# EAGLE board DP_current_measure_v2 (EAGLE 9.4.2)
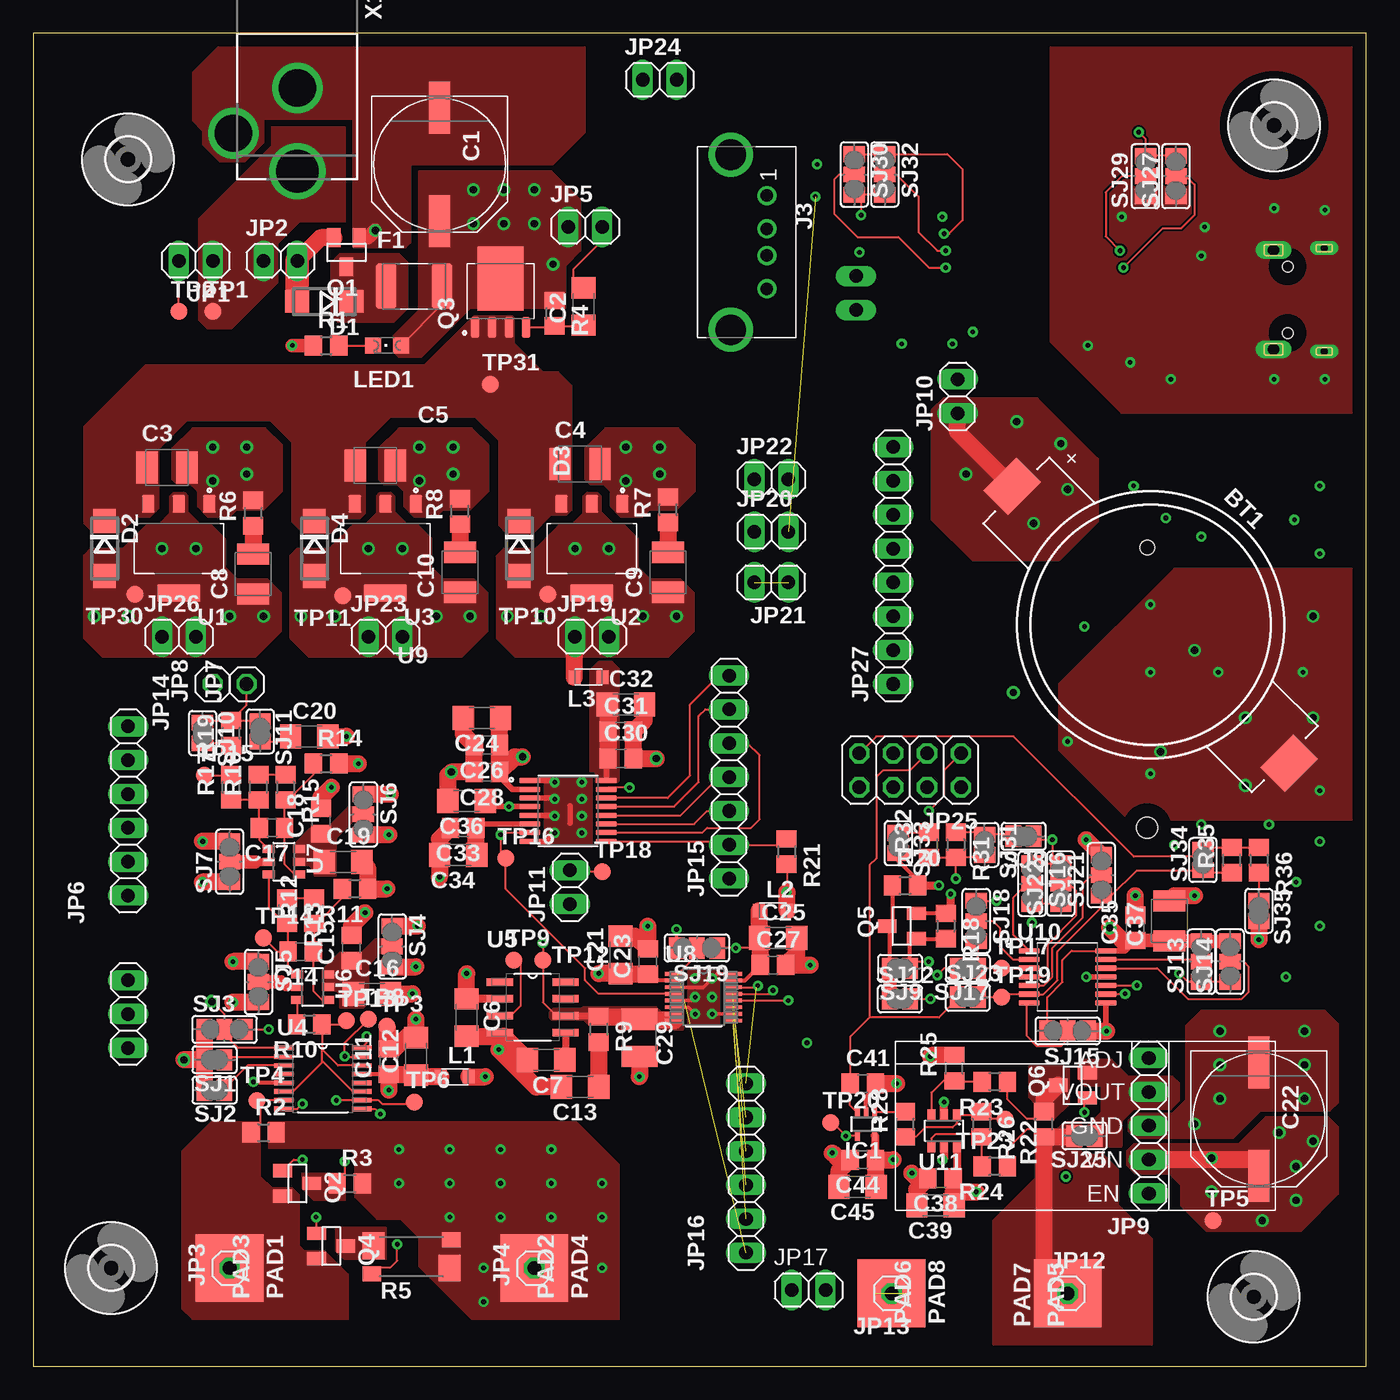
[diagram p5: board, top side]
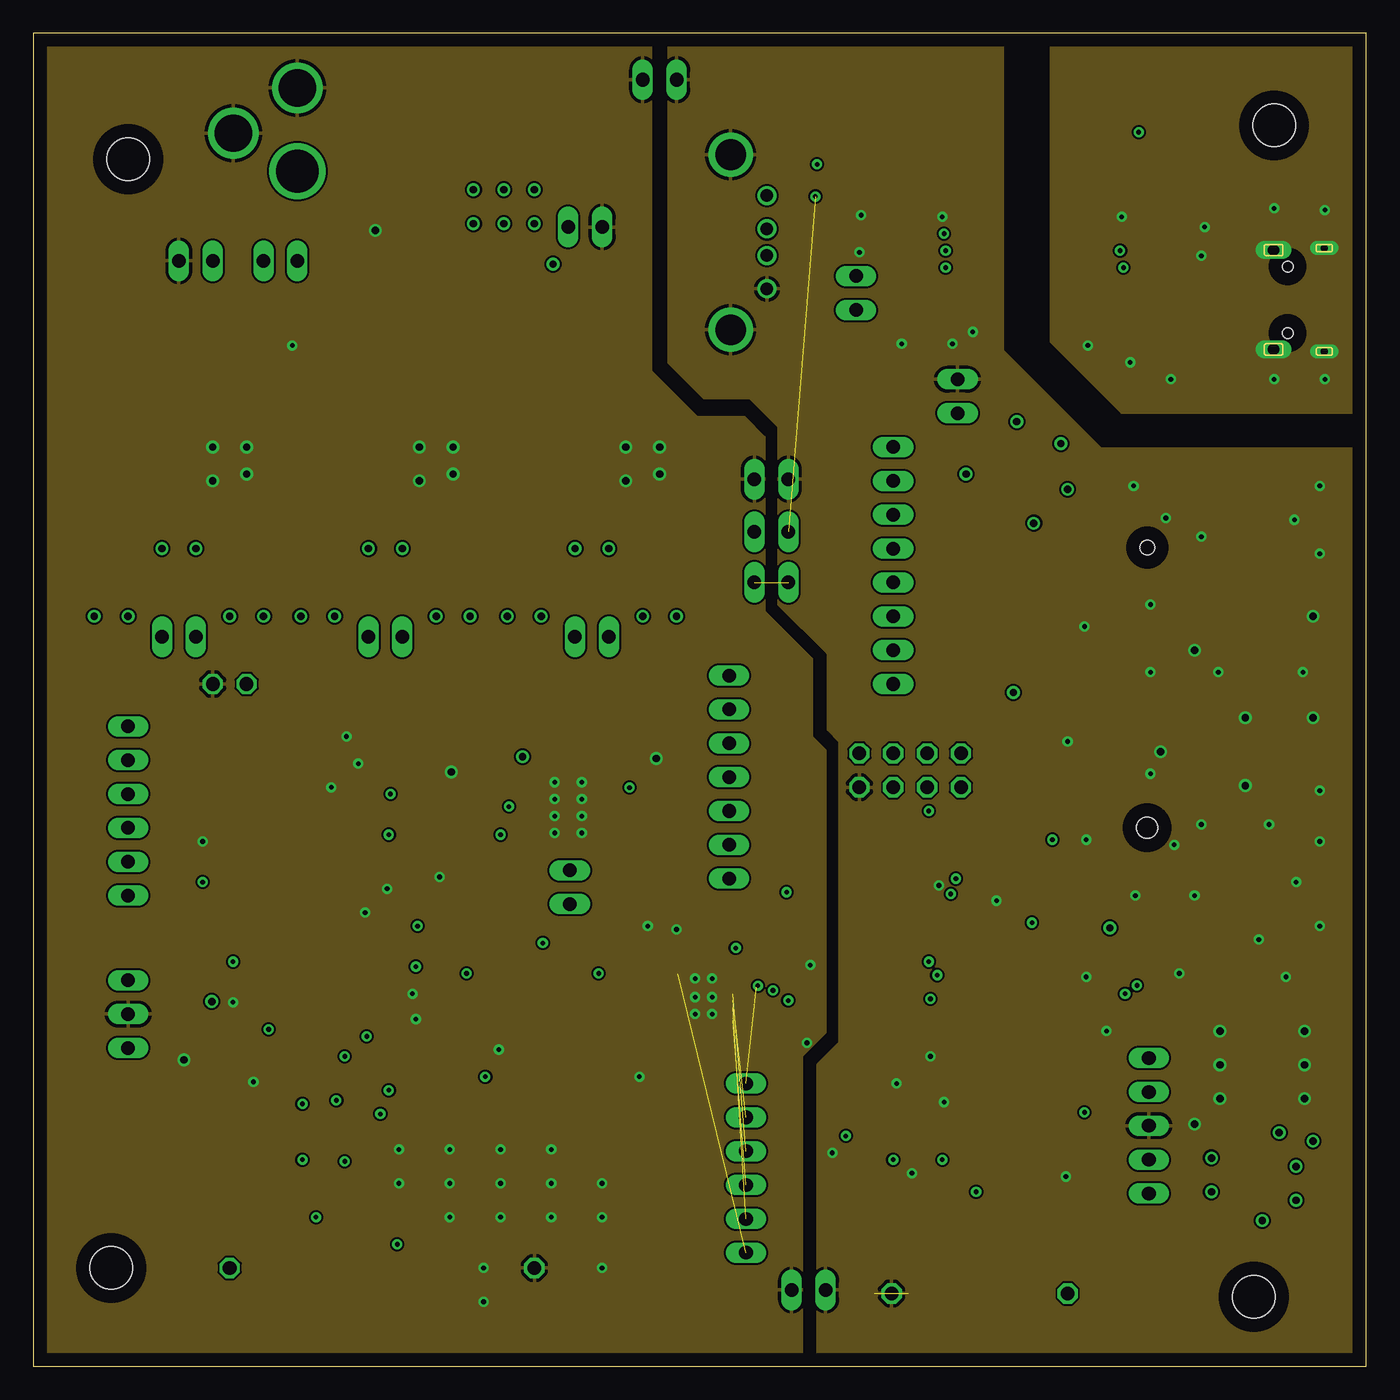
[diagram p6: board, inner layer Route2]
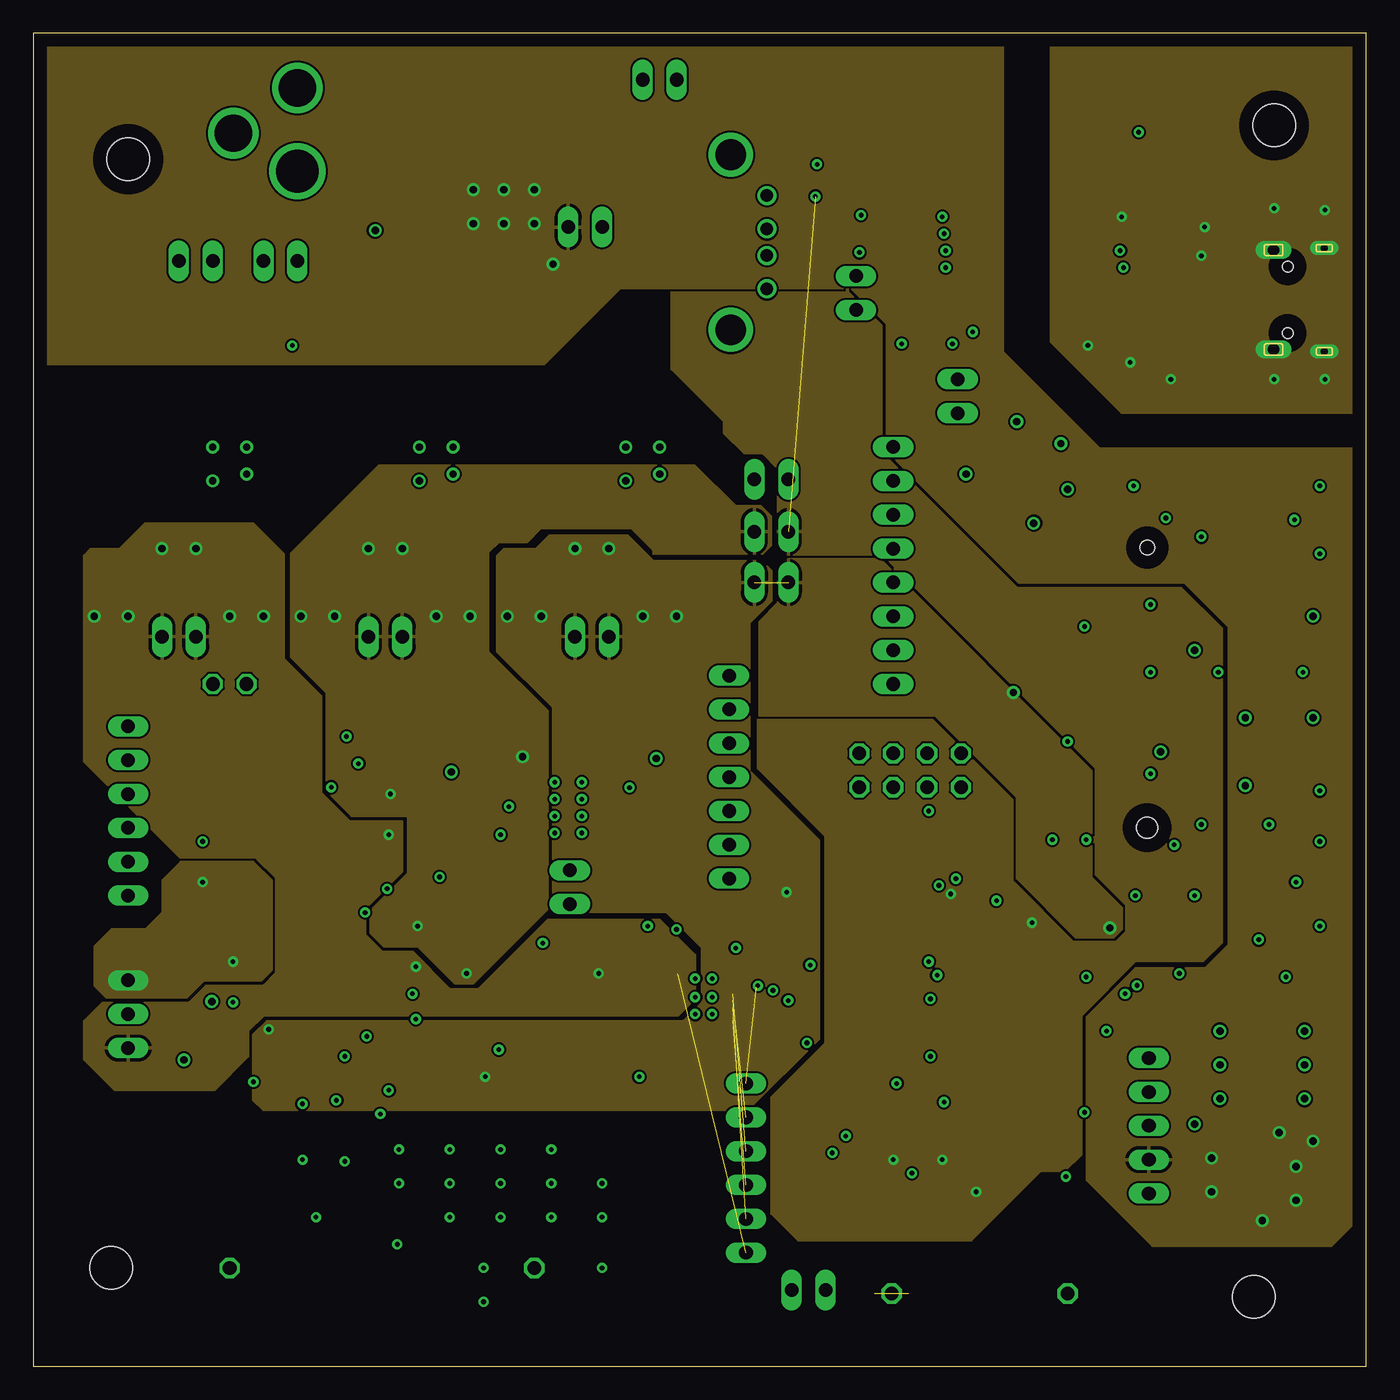
[diagram p7: board, inner layer Route15]
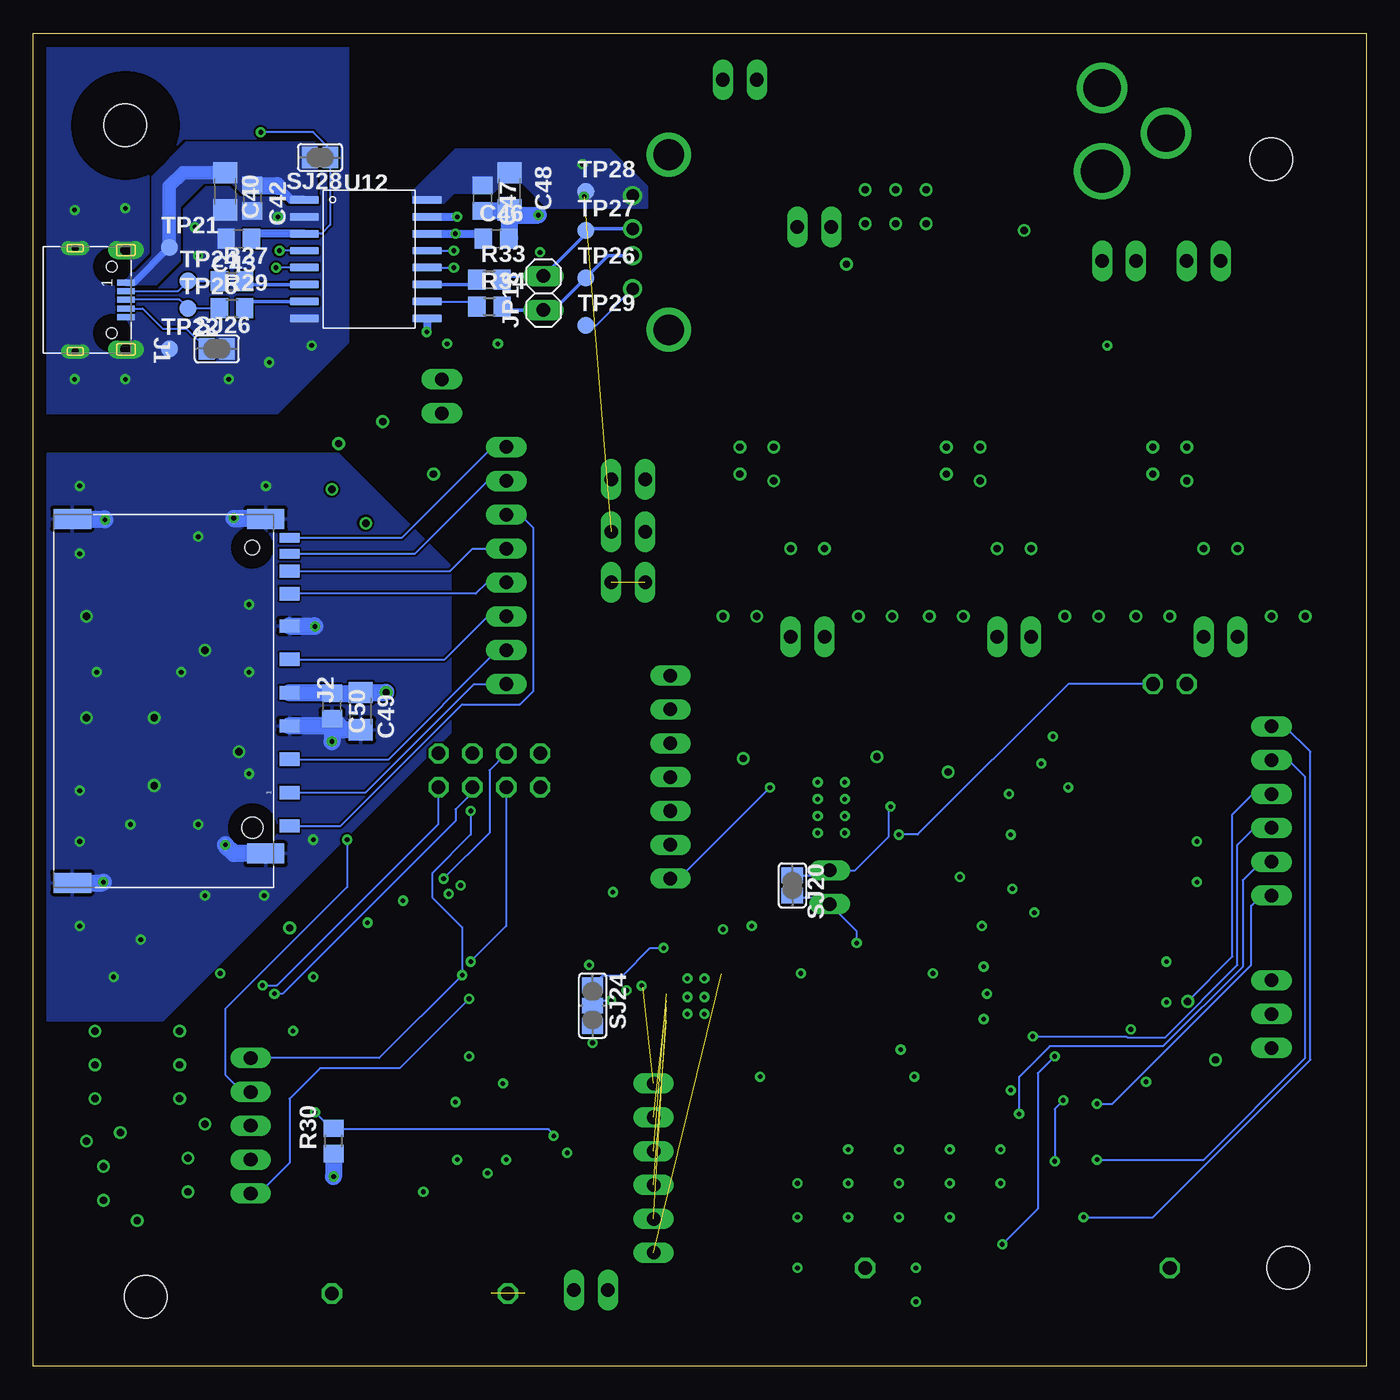
[diagram p8: board, bottom side, seen from below]

Size 100 x 100 mm. Coordinates in mm from the lower left corner, seen from the top.
Outline: 0,0 100,0 100,100 0,100 0,0
Copper layers (1+2*15+16): Top 0.035mm / dielectric 0.2mm / Route2 0.0175mm / dielectric 1.065mm / Route15 0.0175mm / dielectric 0.2mm / Bottom 0.035mm
Design rules "default *": minimum track width 6mil, minimum drill 0.35mm, track to track 6mil, track to pad 6mil, pad to pad 6mil, via to via 6mil, smd to smd 6mil, copper to edge 40mil, drill to drill 6mil, minimum pad ring 10mil, minimum via ring 8mil, stop-mask expansion 4mil, vias tented up to drill 0mil, thermal gap 10mil
Net classes: 1 diff_pair: width 0.254 mm

## Footprints (pad centres in the part's own frame; a part is rotated, then mirrored left to right if it is on the bottom)
RENATA_SMTU2032-1 = smd 2.6 x 3.5: 1 -14.7,0; 2 14.7,0
PANASONIC_G = smd 3.9 x 1.6: + 4.25,0; - -4.25,0
C1206 = smd 1.6 x 1.8: 1 -1.4,0; 2 1.4,0
SMC_B = smd 1.6 x 2.4: + -1.5,0; - 1.5,0
C0805 = smd 1.3 x 1.5: 1 -0.95,0; 2 0.95,0
C1210 = smd 1.6 x 2.7: 1 -1.4,0; 2 1.4,0
DO214AC = smd 1.8 x 1.7: A 2.05,0; C -2.05,0
1812 = smd 1.58 x 3.43: 1 -2.1,0; 2 2.1,0
3,2 = hole 3.2: 0,0
SC70-5L = smd 0.35 x 0.8: 1 -0.65,-0.85; 2 0,-0.85; 3 0.65,-0.85; 4 0.65,0.85; 5 -0.65,0.85
629105150521 = smd 0.45 x 1.3: 1 -1.3,1.05; 2 -0.65,1.05; 3 0,1.05; 4 0.65,1.05; 5 1.3,1.05 | drill 0.85 pad 1.2 long: SHELL -3.725,1.05; SHELL1 3.725,1.05 | drill 0.55 pad 0.9 long: SHELL2 -3.875,-2.75; SHELL3 3.875,-2.75 | hole 0.8: -2.5,0; 2.5,0
693063020911 = smd 1 x 1.5: 1 6.875,0; 2 4.375,0; 3 1.875,0; 4 -0.625,0; 5 -3.125,0; 6 -5.625,0; 7 -8.05,0; 8 -9.75,0; 9 9.375,0 | smd 0.7 x 1.5: CD -11.05,0; WP -12.25,0 | smd 1.5 x 2.8: GND1 -13.65,-1.8; GND2 11.45,-1.8; GND3 13.65,-16.3; GND4 -13.65,-16.3 | hole 1.1: -11.5,-2.8 | hole 1.6: 9.5,-2.8
614004185023 = drill 0.92: 1 -3.5,2.71; 2 -1,2.71; 3 1,2.71; 4 3.5,2.71 | drill 2.3: SHELL 6.57,0; SHELL1 -6.57,0
1X02 = drill 1.016 long: 1 -1.27,0; 2 1.27,0
1X01 = drill 1.016 octagon: 1 0,0
1X03 = drill 1.016 long: 1 -2.54,0; 2 0,0; 3 2.54,0
1X05 = drill 1.016 long: 1 -5.08,0; 2 -2.54,0; 3 0,0; 4 2.54,0; 5 5.08,0
1X06 = drill 1.016 long: 1 -6.35,0; 2 -3.81,0; 3 -1.27,0; 4 1.27,0; 5 3.81,0; 6 6.35,0
1X07 = drill 1.016 long: 1 -7.62,0; 2 -5.08,0; 3 -2.54,0; 4 0,0; 5 2.54,0; 6 5.08,0; 7 7.62,0
2X04 = drill 1.016 octagon: 1 -3.81,-1.27; 2 -3.81,1.27; 3 -1.27,-1.27; 4 -1.27,1.27; 5 1.27,-1.27; 6 1.27,1.27; 7 3.81,-1.27; 8 3.81,1.27
1X08 = drill 1.016 long: 1 -8.89,0; 2 -6.35,0; 3 -3.81,0; 4 -1.27,0; 5 1.27,0; 6 3.81,0; 7 6.35,0; 8 8.89,0
WE-CBF_0805(W=3.0) = smd 0.9 x 1: 1 -1.05,0; 2 1.05,0
CHIPLED_0805 = smd 1.2 x 1.2: A 0,-1.05; C 0,1.05
SMD2,54-5,08 = smd 2.54 x 5.08: 1 0,0
SOT23 = smd 1 x 1.4: 1 -0.95,-1.1; 2 0.95,-1.1; 3 0,1.1
TO127P600X120-5N = smd 0.64 x 1.57: 1 -1.905,-2.57; 2 -0.635,-2.57; 3 0.635,-2.57; 4 1.905,-2.57 | smd 3.47 x 4.8: 5 0,1.06
R0805 = smd 1.3 x 1.5: 1 -0.95,0; 2 0.95,0
R2512 = smd 1.39 x 1.14: E1 -0.13,-2.105; E2 5.84,0.435 | smd 1.65 x 2.01: I1 0,0; I2 5.71,-1.67
SJ = smd 1.168 x 1.6: 1 -0.762,0; 2 0.762,0
SJ_2 = smd 1.168 x 1.6: 1 -1.524,0; 2 0,0; 3 1.524,0
B1,27 = smd 1.27 x 1.27: TP 0,0
SOT229P700X180-4N = smd 0.93 x 1.31: 1 -2.29,-3.345; 2 0,-3.345; 3 2.29,-3.345 | smd 3.24 x 1.31: 4 0,3.345
SOP65P640X110-16N = smd 1.473 x 0.356: 1 -2.921,2.286; 2 -2.921,1.626; 3 -2.921,0.965; 4 -2.921,0.33; 5 -2.921,-0.33; 6 -2.921,-0.965; 7 -2.921,-1.626; 8 -2.921,-2.286; 9 2.921,-2.286; 10 2.921,-1.626; 11 2.921,-0.965; 12 2.921,-0.33; 13 2.921,0.33; 14 2.921,0.965; 15 2.921,1.626; 16 2.921,2.286
SOIC127P600X175-8N = smd 1.981 x 0.559: 1 -2.464,1.905; 2 -2.464,0.635; 3 -2.464,-0.635; 4 -2.464,-1.905; 5 2.464,-1.905; 6 2.464,-0.635; 7 2.464,0.635; 8 2.464,1.905
SOT23-6 = smd 0.6 x 0.9: 1 -0.95,-1.15; 2 0,-1.15; 3 0.95,-1.15; 4 0.95,1.15; 5 0,1.15; 6 -0.95,1.15
MSOP-16_MS = smd 1.397 x 0.279: 1 -2.184,1.751; 2 -2.184,1.251; 3 -2.184,0.751; 4 -2.184,0.25; 5 -2.184,-0.25; 6 -2.184,-0.751; 7 -2.184,-1.251; 8 -2.184,-1.751; 9 2.184,-1.751; 10 2.184,-1.251; 11 2.184,-0.751; 12 2.184,-0.25; 13 2.184,0.25; 14 2.184,0.751; 15 2.184,1.251; 16 2.184,1.751
SOP65P640X120-16N = smd 1.57 x 0.41: 1 -2.87,2.275; 2 -2.87,1.625; 3 -2.87,0.975; 4 -2.87,0.325; 5 -2.87,-0.325; 6 -2.87,-0.975; 7 -2.87,-1.625; 8 -2.87,-2.275; 9 2.87,-2.275; 10 2.87,-1.625; 11 2.87,-0.975; 12 2.87,-0.325; 13 2.87,0.325; 14 2.87,0.975; 15 2.87,1.625; 16 2.87,2.275
SOP65P640X120-14N = smd 1.57 x 0.41: 1 -2.87,1.95; 2 -2.87,1.3; 3 -2.87,0.65; 4 -2.87,0; 5 -2.87,-0.65; 6 -2.87,-1.3; 7 -2.87,-1.95; 8 2.87,-1.95; 9 2.87,-1.3; 10 2.87,-0.65; 11 2.87,0; 12 2.87,0.65; 13 2.87,1.3; 14 2.87,1.95
SO16W = smd 2.2 x 0.6: 1 -4.6,4.445; 2 -4.6,3.175; 3 -4.6,1.905; 4 -4.6,0.635; 5 -4.6,-0.635; 6 -4.6,-1.905; 7 -4.6,-3.175; 8 -4.6,-4.445; 9 4.6,-4.445; 10 4.6,-3.175; 11 4.6,-1.905; 12 4.6,-0.635; 13 4.6,0.635; 14 4.6,1.905; 15 4.6,3.175; 16 4.6,4.445
DCJACK_2MM_PTH = drill 2.8: GND 0,7.35; GNDBREAK 4.8,10.75 | drill 3.2: PWR 0,13.6

## Placement (x,y rotation side)
BT1  SMTU2032-1  [RENATA_SMTU2032-1]  83.82,55.63 315 top
C1  470u  [PANASONIC_G]  30.48,90.17 270 top
C2  10u  [C1206]  41.27,79.5 90 top
C3  10u  [SMC_B]  10.03,67.44 0 top
C4  10u  [SMC_B]  41.02,67.69 0 top
C5  10u  [SMC_B]  25.65,67.56 0 top
C6  10u  [C1206]  32.51,26.16 270 top
C7  10u  [C1206]  38.48,22.99 180 top
C8  10u  [SMC_B]  16.51,59.44 90 top
C9  10u  [SMC_B]  47.62,59.56 90 top
C10  10u  [SMC_B]  32,59.56 90 top
C11  100n  [C0805]  26.67,22.86 90 top
C12  10u  [C1206]  28.7,23.24 90 top
C13  10u  [C1206]  41.02,20.95 180 top
C14  10p  [C0805]  20.07,31.11 180 top
C15  100n  [C0805]  23.88,31.37 90 top
C16  10u  [C1206]  25.4,27.94 0 top
C17  10p  [C0805]  17.91,40.39 180 top
C18  100n  [C0805]  21.59,40.89 90 top
C19  10u  [C1206]  23.24,37.85 0 top
C20  100n  [C1206]  20.7,47.24 0 top
C21  10u  [C1206]  44.07,30.86 90 top
C22  470u  [PANASONIC_G]  91.95,18.54 270 top
C23  100n  [C0805]  46.1,30.35 90 top
C24  10u  [C1206]  33.66,48.64 180 top
C25  10u  [C1206]  55.88,32.13 0 top
C26  1u  [C0805]  34.04,46.61 180 top
C27  100n  [C0805]  55.5,30.1 0 top
C28  100n  [C0805]  34.04,44.58 180 top
C29  47u  [C1210]  45.47,24.64 270 top
C30  100n  [C0805]  44.07,45.59 0 top
C31  1u  [C0805]  44.07,47.62 0 top
C32  10u  [C1206]  44.45,49.66 0 top
C33  1u  [C0805]  32.26,40.39 180 top
C34  10u  [C1206]  31.88,38.35 180 top
C35  100n  [C0805]  82.68,32.89 90 top
C36  10u  [C1206]  32.51,42.42 180 top
C37  10u  [SMC_B]  85.22,33.4 90 top
C38  100n  [C0805]  68.07,14.1 180 top
C39  10u  [C1206]  67.69,12.06 180 top
C40  10u  [C1206]  85.6,88.14 270 bottom
C41  100n  [C0805]  62.23,21.21 0 top
C42  100n  [C0805]  83.57,87.63 270 bottom
C43  100n  [C0805]  84.58,84.58 180 bottom
C44  100n  [C0805]  62.23,15.49 180 top
C45  10u  [C1206]  61.85,13.46 180 top
C46  100n  [C0805]  65.28,84.58 0 bottom
C47  100n  [C0805]  66.29,87.63 270 bottom
C48  10u  [C1206]  64.26,88.14 270 bottom
C49  10u  [C1206]  75.44,49.15 270 bottom
C50  100n  [C0805]  77.6,49.53 270 bottom
D1  S3M  [DO214AC]  21.84,79.88 180 top
D2  S3M  [DO214AC]  5.33,61.34 270 top
D3  S3M  [DO214AC]  36.45,61.34 270 top
D4  S3M  [DO214AC]  21.08,61.34 270 top
F1  [1812]  28.57,81.03 0 top
H1  MOUNT-HOLE3.2  [3,2]  93.09,93.09 0 top
H2  MOUNT-HOLE3.2  [3,2]  5.84,7.37 0 top
H3  MOUNT-HOLE3.2  [3,2]  91.57,5.21 0 top
H4  MOUNT-HOLE3.2  [3,2]  7.11,90.55 0 top
IC1  LMV321M7  [SC70-5L]  62.48,18.16 180 top
J1  [629105150521]  94.11,80.01 270 bottom
J2  [693063020911]  80.77,49.91 270 bottom
J3  [614004185023]  52.32,84.33 270 top
JP1  [1X02]  12.19,82.93 180 top
JP2  [1X02]  18.54,82.93 0 top
JP3  [1X01]  14.73,7.37 90 top
JP4  [1X01]  37.59,7.37 90 top
JP5  [1X02]  41.4,85.47 0 top
JP6  [1X03]  7.11,26.42 270 top
JP7  [1X01]  16,51.18 90 top
JP8  [1X01]  13.46,51.18 90 top
JP9  [1X05]  83.69,18.03 90 top
JP10  [1X02]  69.34,72.77 90 top
JP11  [1X02]  40.26,35.94 90 top
JP12  [1X01]  77.6,5.46 0 top
JP13  [1X01]  64.39,5.46 180 top
JP14  [1X06]  7.11,41.66 270 top
JP15  [1X07]  52.2,44.2 90 top
JP16  [1X06]  53.47,14.86 90 top
JP17  [1X02]  58.17,5.71 0 top
JP18  [1X02]  61.72,80.52 90 bottom
JP19  [1X02]  41.91,54.74 0 top
JP20  [1X02]  55.37,62.61 0 top
JP21  [1X02]  55.37,58.8 180 top
JP22  [1X02]  55.37,66.55 0 top
JP23  [1X02]  26.42,54.74 0 top
JP24  [1X02]  46.99,96.52 0 top
JP25  [2X04]  65.79,44.7 180 top
JP26  [1X02]  10.92,54.74 0 top
JP27  [1X08]  64.52,60.07 90 top
L1  [WE-CBF_0805(W=3.0)]  31.62,21.72 0 top
L2  [WE-CBF_0805(W=3.0)]  55.5,34.16 0 top
L3  [WE-CBF_0805(W=3.0)]  41.66,51.69 180 top
LED1  [CHIPLED_0805]  26.54,76.58 90 top
PAD1  [SMD2,54-5,08]  16,7.37 180 top
PAD2  [SMD2,54-5,08]  36.32,7.37 180 top
PAD3  [SMD2,54-5,08]  13.46,7.37 180 top
PAD4  [SMD2,54-5,08]  38.86,7.37 180 top
PAD5  [SMD2,54-5,08]  78.87,5.46 0 top
PAD6  [SMD2,54-5,08]  63.12,5.46 180 top
PAD7  [SMD2,54-5,08]  76.33,5.46 0 top
PAD8  [SMD2,54-5,08]  65.66,5.46 180 top
Q1  DMG3401LSN-7  [SOT23]  23.5,83.57 180 top
Q2  DMG3401LSN-7  [SOT23]  19.81,13.72 270 top
Q3  PHPT60603NYX  [TO127P600X120-5N]  35.05,80.52 0 top
Q4  DMG3401LSN-7  [SOT23]  22.35,9.02 270 top
Q5  DMG3401LSN-7  [SOT23]  65.15,33.02 90 top
Q6  DMG3401LSN-7  [SOT23]  77.98,21.08 90 top
R1  10K  [R0805]  21.97,76.58 0 top
R2  10K  [R0805]  17.27,17.53 0 top
R3  10R  [R0805]  23.75,13.72 0 top
R4  1K  [R0805]  39.12,78.99 270 top
R5  R01  [R2512]  31.24,7.37 180 top
R6  ESR  [R0805]  16.51,64.01 90 top
R7  ESR  [R0805]  47.62,64.26 90 top
R8  ESR  [R0805]  32,64.14 90 top
R9  ESR  [R0805]  42.42,25.27 270 top
R10  270R  [R0805]  20.7,25.65 180 top
R11  1K  [R0805]  24.13,35.81 180 top
R12  6K8  [R0805]  21.08,34.16 90 top
R13  2K2  [R0805]  19.05,34.16 270 top
R14  1K  [R0805]  21.97,45.21 0 top
R15  6K8  [R0805]  18.92,43.43 270 top
R16  2K2  [R0805]  16.89,43.43 90 top
R17  270R  [R0805]  14.86,43.43 90 top
R18  10K  [R0805]  68.45,33.02 270 top
R19  1K  [R0805]  14.86,47.5 90 top
R20  10K  [R0805]  65.41,36.07 0 top
R21  10K  [R0805]  56.52,38.61 270 top
R22  0R01  [R0805]  75.82,18.16 90 top
R23  2K  [R0805]  72.14,21.34 180 top
R24  2K  [R0805]  72.14,14.99 180 top
R25  1Meg  [R0805]  69.09,22.35 90 top
R26  1Meg  [R0805]  71.12,18.16 270 top
R27  24R  [R0805]  85.09,81.41 0 bottom
R28  2K  [R0805]  65.41,18.16 90 top
R29  24R  [R0805]  85.09,79.38 0 bottom
R30  10K  [R0805]  77.47,16.89 90 bottom
R31  10K  [R0805]  69.22,39.12 270 top
R32  10K  [R0805]  67.18,39.12 90 top
R33  24R  [R0805]  65.79,81.53 0 bottom
R34  24R  [R0805]  65.79,79.5 0 bottom
R35  10K  [R0805]  89.92,37.97 90 top
R36  10K  [R0805]  91.95,37.97 270 top
SJ1  [SJ]  13.59,22.99 180 top
SJ2  [SJ]  13.59,20.7 180 top
SJ3  [SJ_2]  14.35,25.27 0 top
SJ4  [SJ_2]  26.92,31.5 270 top
SJ5  [SJ_2]  16.89,28.83 270 top
SJ6  [SJ_2]  24.77,41.4 270 top
SJ7  [SJ_2]  14.73,37.85 90 top
SJ8  [SJ]  74.3,39.75 180 top
SJ9  [SJ]  65.02,29.84 180 top
SJ10  [SJ]  12.7,47.5 270 top
SJ11  [SJ]  17.02,47.62 270 top
SJ12  [SJ]  65.02,27.56 0 top
SJ13  [SJ_2]  87.63,30.35 90 top
SJ14  [SJ_2]  89.79,30.35 90 top
SJ15  [SJ_2]  77.6,25.15 180 top
SJ16  [SJ_2]  74.93,36.2 270 top
SJ17  [SJ]  70.1,29.84 180 top
SJ18  [SJ_2]  70.74,33.4 270 top
SJ19  [SJ_2]  49.78,31.37 180 top
SJ20  [SJ]  43.05,36.07 270 bottom
SJ21  [SJ_2]  80.14,36.83 90 top
SJ22  [SJ_2]  77.09,36.2 90 top
SJ23  [SJ]  70.1,27.69 0 top
SJ24  [SJ_2]  58.04,27.05 270 bottom
SJ25  [SJ]  78.87,17.27 180 top
SJ26  [SJ]  86.23,76.33 0 bottom
SJ27  [SJ_2]  85.72,89.28 90 top
SJ28  [SJ]  78.49,90.68 180 bottom
SJ29  [SJ_2]  83.44,89.28 90 top
SJ30  [SJ_2]  61.59,89.41 270 top
SJ31  [SJ]  71.37,39.12 270 top
SJ32  [SJ_2]  63.88,89.41 270 top
SJ33  [SJ]  64.9,39.24 270 top
SJ34  [SJ]  87.76,37.97 90 top
SJ35  [SJ]  91.95,34.16 270 top
TP1  TPSB1,27  [B1,27]  13.46,79.12 0 top
TP2  TPSB1,27  [B1,27]  10.92,79.12 0 top
TP3  TPSB1,27  [B1,27]  26.54,25.53 0 top
TP4  TPSB1,27  [B1,27]  16.76,19.94 0 top
TP5  TPSB1,27  [B1,27]  88.52,10.92 0 top
TP6  TPSB1,27  [B1,27]  28.57,19.81 0 top
TP8  TPSB1,27  [B1,27]  25.15,26.04 0 top
TP9  TPSB1,27  [B1,27]  36.07,30.48 0 top
TP10  TPSB1,27  [B1,27]  38.61,57.91 180 top
TP11  TPSB1,27  [B1,27]  23.24,57.78 180 top
TP12  TPSB1,27  [B1,27]  38.23,30.48 0 top
TP13  TPSB1,27  [B1,27]  23.5,25.91 0 top
TP14  TPSB1,27  [B1,27]  17.27,32.13 0 top
TP15  TPSB1,27  [B1,27]  12.83,44.32 0 top
TP16  TPSB1,27  [B1,27]  35.43,38.1 0 top
TP17  TPSB1,27  [B1,27]  72.64,29.84 0 top
TP18  TPSB1,27  [B1,27]  42.67,37.08 0 top
TP19  TPSB1,27  [B1,27]  72.64,27.69 0 top
TP20  TPSB1,27  [B1,27]  59.82,18.29 0 top
TP21  TPSB1,27  [B1,27]  89.79,83.95 0 bottom
TP22  TPSB1,27  [B1,27]  89.79,76.33 0 bottom
TP23  TPSB1,27  [B1,27]  72.9,18.54 180 top
TP24  TPSB1,27  [B1,27]  88.39,81.41 0 bottom
TP25  TPSB1,27  [B1,27]  88.39,79.38 0 bottom
TP26  TPSB1,27  [B1,27]  58.55,81.66 0 bottom
TP27  TPSB1,27  [B1,27]  58.55,85.22 0 bottom
TP28  TPSB1,27  [B1,27]  58.55,88.14 0 bottom
TP29  TPSB1,27  [B1,27]  58.55,78.11 0 bottom
TP30  TPSB1,27  [B1,27]  7.62,57.91 180 top
TP31  TPSB1,27  [B1,27]  34.29,73.66 0 top
U1  AMS1117-2.5  [SOT229P700X180-4N]  10.92,61.34 180 top
U2  AMS1117-3.3  [SOT229P700X180-4N]  41.91,61.34 180 top
U3  AMS1117-5.0  [SOT229P700X180-4N]  26.42,61.34 180 top
U4  TMUX1111PWRTSSOP16  [SOP65P640X110-16N]  21.72,21.59 0 top
U5  REF5050IDR  [SOIC127P600X175-8N]  37.47,26.92 0 top
U6  MAX4239AUT+T  [SOT23-6]  20.95,28.45 270 top
U7  MAX4239AUT+T  [SOT23-6]  18.8,37.85 270 top
U8  LTC2368IMS-16PBF  [MSOP-16_MS]  50.29,27.69 0 top
U9  ADS8681IPWR  [SOP65P640X120-16N]  40.13,41.66 0 top
U10  TPL0102-100PWRTSSOP14  [SOP65P640X120-14N]  77.6,29.21 0 top
U11  MAX4239AUT+T  [SOT23-6]  68.33,17.65 180 top
U12  ADUM3160  [SO16W]  75.06,83.06 0 bottom
X1  [DCJACK_2MM_PTH]  19.81,103.25 180 top

## Tracks (layer width: path | path; a pad name or v marks a point on that pad's centre or on a via)
+2V5  (via drill 0.35, 0.55)
  Top 0.305: U8.2 46.57,28.94 C23.1
  Top 1.27: SJ4.3 v28.7,29.97 | SJ6.3 v26.67,39.88 | C23.1 44.13,29.4 C21.1 v42.42,29.46
  other vias: 17.27,56.26 14.73,56.26 12.19,61.34 9.65,61.34 7.11,56.26 4.57,56.26
  pour Top (no thermals): 4.32,61.34 6.73,61.34 8.51,63.12 9.4,63.12 10.29,64.01 10.29,65.28 10.54,65.53 11.3,65.53 11.56,65.28 11.56,64.14 12.57,63.12 13.34,63.12 14.35,62.1 14.35,59.94 15.24,59.05 17.53,59.05 18.54,58.04 18.54,55.12 16.64,53.21 5.21,53.21 3.81,54.61 3.81,60.83
  pour Route15 (rank 4): 8.38,63.25 16.51,63.25 18.8,60.96 18.8,53.09 21.59,50.29 21.59,43.05 23.75,40.89 27.69,40.89 27.69,37.08 24.89,34.29 24.89,32.38 26.16,31.11 28.45,31.11 31.24,28.32 33.4,28.32 38.61,33.53 46.99,33.53 49.66,30.86 49.66,27.56 48.39,26.29 17.27,26.29 16.13,25.15 16.13,23.24 13.59,20.7 6.1,20.7 3.81,22.99 3.81,25.91 5.21,27.3 11.68,27.3 12.95,28.57 17.27,28.57 18.16,29.46 18.16,36.58 16.64,38.1 11.05,38.1 3.81,45.34 3.81,60.83 4.32,61.34 6.48,61.34
+3V3  (via drill 0.35, 0.55)  (1 unrouted)
  Top 0.152: SJ15.3 76.07,27.69 77.22,28.83 77.22,30.48 77.9,31.16 U10.14 | SJ3.3 v17.65,25.27 | R21.2 56.55,37.62 56.55,35.53
  Top 0.406: U10.14 81.89,31.16 C35.1
  Top 1.016: C35.1 85.17,31.94 C37.+ 87.61,31.9 SJ13.3 SJ14.3
  Top 1.27: L3.2 40.61,54.7 JP19.1 | L2.2 56.55,35.53 v56.52,35.56 | L1.2 v33.91,21.72 | C35.1 81.71,31.94 v80.76,32.88
  Bottom 1.27: J2.4 77.65,50.54 C50.1 75.51,50.48 C49.1 v73.54,50.55 v73.53,50.55
  other vias: 35.56,56.26 38.1,56.26 40.64,61.34 43.18,61.34 45.72,56.26 48.26,56.26
  pour Top (no thermals): 35.31,61.34 37.72,61.34 39.5,63.12 40.39,63.12 41.27,64.01 41.27,65.28 41.53,65.53 42.29,65.53 42.55,65.28 42.55,64.14 43.56,63.12 44.32,63.12 45.34,62.1 45.34,59.94 46.23,59.05 48.51,59.05 49.53,58.04 49.53,55.12 47.62,53.21 36.2,53.21 34.8,54.61 34.8,60.83
  pour Route15 (rank 4): 54.61,60.45 55.37,59.69 55.37,57.4 53.72,55.75 53.72,44.7 58.93,39.5 58.93,24.51 53.59,19.18 17.27,19.18 16.51,19.94 16.51,24.89 17.53,25.91 48.77,25.91 50.16,27.3 50.16,31.37 47.5,34.04 38.99,34.04 38.99,49.4 34.8,53.59 34.8,60.83 35.31,61.34 37.72,61.34 38.73,62.36 44.58,62.36 46.48,60.45
  pour Route15 (rank 3): 55.88,59.82 56.64,60.58 63.5,60.58 79.38,44.7 79.38,36.7 81.66,34.42 81.66,32.77 81.03,32.13 78.23,32.13 73.79,36.58 73.79,42.67 67.69,48.77 54.48,48.77 54.48,55.88 55.88,57.28
+5V  (via drill 0.35)  (1 unrouted)
  Top 0.152: SJ22.1 SJ16.3 v74.93,33.27
  Top 0.305: R18.1 Q5.2
  Top 0.61: U11.6 69.28,14.35 C38.1 | 69.02,12.13 C39.1 | IC1.5 63.13,15.54 C44.1 | 63.18,13.53 C45.1 | R18.1 68.83,34.35 v68.83,35.43 | U11.5 68.33,15.62 v68.2,15.49
  Top 1.27: C38.1 69.02,13.08 | 69.02,13.08 69.02,12.13 | 69.02,13.08 v70.74,13.08 | 63.18,13.53 C44.1 v64.52,15.49
  other vias: 58.67,87.76 58.8,90.17
  pour Bottom (no thermals): 53.98,88.52 53.98,86.87 61.4,86.87 63.31,88.77 64.77,88.77 65.53,88.01 68.45,88.01 69.22,87.25 71.5,87.25 71.5,88.14 68.33,91.31 56.77,91.31
  pour Route15 (rank 4): 49.91,91.31 61.21,91.31 63.63,88.9 63.63,68.58 73.79,58.42 86.11,58.42 89.15,55.37 89.15,31.75 87.76,30.35 82.68,30.35 78.61,26.29 78.61,15.88 77.34,14.61 75.56,14.61 70.36,9.4 57.4,9.4 55.37,11.43 55.37,20.19 59.44,24.26 59.44,39.75 54.36,44.83 54.36,55.75 55.88,57.28 55.88,67.31 54.74,68.45 53.34,68.45 51.82,69.98 51.82,70.87 47.88,74.8 47.88,89.28
+5V/1
  Bottom 0.508: J1.1 92.43,81.31 TP21.TP
  Bottom 0.61: U12.1 80.64,87.5 81.66,88.52
  Bottom 1.016: TP21.TP 89.79,88.52 88.77,89.54 C40.1
  Bottom 1.27: C42.1 81.72,88.58 81.66,88.52
  pour Bottom (no thermals): 78.74,91.57 78.74,87.25 80.77,87.25 81.53,88.01 84.33,88.01 85.09,88.77 87.25,88.77 89.03,87 89.03,82.93 90.81,81.15 93.73,81.15 93.73,81.41 93.09,82.04 92.33,82.04 91.06,83.31 91.06,89.28 88.52,91.82 78.99,91.82
AGND  (via drill 0.35, 0.55)
  Top 0.152: C2.2 40.51,81.66 40.51,82.3 42.67,84.45 JP5.2 | U5.4 35.05,25.02 35.31,24.76 | TP2.TP JP1.2
  Top 0.254: U8.3 50.28,28.44 v50.93,29.08 51.28,29.44 U8.16 | U8.5 49.41,27.44 v49.66,27.69 | U8.6 49.14,26.93 v49.66,26.42 | U8.10 52.46,26.42 v50.93,26.42 | SJ19.3 v48.26,32.77
  Top 0.305: U4.5 16.59,21.26 v16.51,21.34
  Top 0.406: 40.26,40.77 40.26,42.04 | U9.3 39.03,42.63 v39.12,42.55 | U9.5 39.06,41.33 v39.12,41.27 | U9.8 38.49,39.38 v39.12,40.01 | U9.1 39,43.93 v39.12,43.81
  Top 1.016: Q1.1 25.1,84.67 v25.65,85.22 | R1.1 v19.43,76.58
  Top 1.27: TP3.TP 26.54,23.94 C11.2 27.11,23.81 28.07,24.77 28.58,24.77 C12.2 v28.7,26.04 | C16.2 v28.45,27.94 | C15.2 23.88,33.02 v24.89,34.04 | v26.54,35.81 R11.1 25.08,37.41 C19.2 | SJ5.3 v14.99,27.3 | SJ7.3 v12.7,39.37 | C18.2 21.59,42.67 v22.35,43.43 | R14.2 v24.38,45.21 | C20.2 v23.5,47.24 | C33.2 30.48,39.55 C34.2 v30.48,36.71 v30.48,36.7 | C24.2 32.26,47.44 C26.2 C28.2 v31.37,44.58 31.11,44.32 C36.2 | C32.2 45.85,48.46 C31.2 C30.2 v46.74,45.59 | SJ3.1 SJ1.2 | SJ1.2 SJ2.2 | SJ1.2 v11.3,22.99 | C21.2 45.14,32.26 C23.2 v46.1,33.02 | C25.2 57.28,30.93 C27.2 v58.29,30.1 | C29.2 v45.47,21.72 | C6.2 35.31,24.76 C7.2 35.69,22.99 v34.92,23.75 37.72,20.95 C13.2
  Bottom 0.152: SJ24.3 v58.04,24.26
  other vias: 35.05,11.18 38.86,11.18 35.05,13.72 38.86,13.72 35.05,16.26 38.86,16.26 31.24,16.26 31.24,13.72 42.67,13.72 42.67,11.18 42.67,7.37 33.78,4.83 33.78,7.37 27.43,13.72 27.43,16.26 31.24,11.18 13.46,68.96 16,68.96 16,66.93 13.46,66.42 28.96,68.96 31.5,68.96 31.5,66.93 28.96,66.42 44.45,68.96 46.99,68.96 46.99,66.93 44.45,66.42 41.15,40.01 41.15,41.27 41.15,42.55 41.15,43.81 50.93,27.69 49.66,29.08
  pour Top (no thermals): 40.77,18.29 17.65,18.29 17.65,16.38 23.62,16.38 24.13,15.88 24.13,12.7 25.78,11.05 27.56,11.05 28.96,9.65 28.96,7.49 32.89,3.56 43.94,3.56 43.94,15.11
  pour Top (no thermals): 10.41,68.83 10.41,66.55 10.79,66.17 11.81,66.17 12.32,65.66 12.32,64.52 13.08,63.75 14.73,63.75 15.24,64.26 17.27,64.26 18.67,65.66 18.67,69.09 17.4,70.36 11.94,70.36
  pour Top (no thermals): 25.91,68.83 25.91,66.55 26.29,66.17 27.3,66.17 27.81,65.66 27.81,64.52 28.57,63.75 30.23,63.75 30.73,64.26 32.77,64.26 34.16,65.66 34.16,69.09 32.89,70.36 27.43,70.36
  pour Top (no thermals): 41.4,68.83 41.4,66.55 41.78,66.17 42.8,66.17 43.31,65.66 43.31,64.52 44.07,63.75 45.72,63.75 46.23,64.26 48.26,64.26 49.66,65.66 49.66,69.09 48.39,70.36 42.93,70.36
  pour Top (no thermals): 24,83.95 27.94,83.95 28.32,84.33 28.32,90.17 38.99,90.17 41.4,92.58 41.4,100.2 15.11,100.2 11.94,97.03 11.94,93.47 12.7,92.71 12.7,91.69 13.97,90.42 15.88,90.42 17.27,91.82 17.27,93.6 24,93.6
  pour Top (no thermals): 38.35,44.32 38.35,38.99 41.91,38.99 41.91,44.32
  pour Top (no thermals): 49.15,29.72 51.44,29.72 51.44,25.65 49.15,25.65
  pour Route2 (rank 5): 46.35,102.23 46.35,74.68 49.78,71.25 53.34,71.25 54.86,69.72 54.86,56.64 58.42,53.09 58.42,47.24 59.44,46.23 59.44,25.02 57.66,23.24 57.66,-9.27 55.63,-11.3 -24.64,-11.3 -34.29,-1.65 -34.29,103.89 -21.84,116.33 32.26,116.33
ASW-1  (via drill 0.55)
  Top 0.152: U4.1 15.37,23.88 14.35,24.89 SJ3.2 14.35,26.4 v13.39,27.36
  Bottom 0.152: v13.39,27.36 13.39,27.38 10.03,30.73 10.03,41.4 8.51,42.93 JP14.3
ASW-2  (via drill 0.35)
  Top 0.152: U4.16 25.02,24.26 v25.02,24.74
  Bottom 0.152: v25.02,24.74 17.98,24.74 17.9,24.67 15.09,24.67 9.65,30.1 9.65,39.12 8.38,40.39 JP14.4
ASW-3  (via drill 0.35)
  Top 0.152: U4.9 25.65,19.3 v26.04,18.92
  Bottom 0.152: v26.04,18.92 26.04,21.72 23.75,24 15.24,24 9.27,29.97 9.27,36.45 7.87,37.85 JP14.5
ASW-4  (via drill 0.35)
  Top 0.152: U4.8 19.81,19.3 v20.19,19.68
  Bottom 0.152: v20.19,19.68 19.05,19.68 8.64,30.1 8.64,34.54 7.87,35.31 JP14.6
BUSY_ADC2  (1 unrouted)
CHAIN_ADC2  (1 unrouted)
  Top 0.152: U8.1 48.36,29.44 49.78,30.86 SJ19.2
CNV_ADC2  (1 unrouted)
CS_ADC1
  Top 0.152: U9.11 49.57,40.68 50.55,41.66 JP15.3
CURR_MEAS_POS
  Top 0.152: R2.1 17.02,18.22 17.02,19.68 TP4.TP 18.77,19.94 U4.7
  pour Top (no thermals): 11.94,3.56 23.62,3.56 23.62,6.86 21.84,8.64 20.32,8.64 19.94,9.02 19.94,12.83 19.43,13.34 17.91,13.34 17.02,14.22 17.02,18.29 13.34,18.29 11.18,16.13 11.18,4.32
CURR_SRC_OUT
  Top 0.152: R22.1 75.25,17.78 74.55,17.78 73.09,16.32 R24.1
  Top 1.27: 78.04,17.21 R22.1 75.82,7.24 JP12.1
  pour Top (no thermals): 78.61,18.29 77.34,18.29 76.83,17.78 75.18,17.78 75.18,14.1 72.01,10.92 72.01,1.65 83.95,1.65 83.95,9.53 81.41,12.06 81.41,14.73 80.26,15.88 78.61,15.88
D+_USB_EXT
  Bottom 0.152: J1.3 89.03,80.01 TP25.TP R29.1
D+_USB_INT
  Bottom 0.254: R34.2 64.58,79.25 JP18.1 60.96,79.25 TP26.TP 56.88,83.33 J3.3
D-_USB_EXT
  Bottom 0.152: J1.2 89.14,80.66 TP24.TP R27.1
D-_USB_INT
  Bottom 0.254: R33.2 64.58,81.79 JP18.2 58.55,84.96 TP27.TP 58.44,85.33 J3.2
DC_OUT_VAR  (via drill 0.35)
  Top 0.152: SJ16.1 76.45,37.72 | 76.45,37.72 SJ22.3 | 76.45,37.72 v76.45,39.5 75.31,39.5 SJ8.1
  Bottom 0.152: JP9.4 84.33,20.57 85.6,21.84 85.6,26.8 76.45,35.94 v76.45,39.5
  pour Top (no thermals): 79.12,16.51 81.66,16.51 81.66,18.41 82.55,19.3 85.34,19.3 85.98,19.94 85.98,21.21 85.47,21.72 82.17,21.72 80.9,22.99 78.87,22.99 78.36,22.48 78.36,21.59 78.87,21.08 80.14,21.08 80.14,19.05 79.12,18.03
GND  (via drill 0.35, 0.55)  (2 unrouted)
  Top 0.152: SJ14.1 SJ13.1 86.61,28.83 v85.98,29.46 | SJ18.1 v72.26,34.92 | SJ32.3 SJ30.3 62.1,87.38 v62.1,86.36
  Top 0.305: IC1.2 62.48,20.19 63.18,20.89 C41.2 | R20.2 66.36,36.45 64.9,37.91 SJ33.2
  Top 0.406: U10.8 80.47,25.2 v80.52,25.15 | U10.11 v78.99,29.21
  Top 0.61: U11.2 v68.33,19.81 | R20.2 v67.94,36.07
  Top 1.27: C41.2 v64.77,21.21 | C39.2 66.29,13.27 C38.2 66.29,14.1 v65.91,14.48 | C45.2 60.45,14.66 C44.2 60.45,15.49 v59.94,16 | C35.2 v82.68,35.31 | C37.- 85.62,35.31 v87.12,35.31 | SJ35.2 v91.95,32 | SJ21.3 v78.99,39.5 | SJ15.1 v80.52,25.15 | R25.2 67.37,23.3 v67.31,23.24
  Bottom 0.152: TP29.TP 57.76,78.11 J3.4
  Bottom 0.61: U12.15 v68.2,86.23 | U12.9 70.46,77.62 v70.48,77.6
  Bottom 1.27: R30.1 v77.47,14.22 | J2.3 78.14,48.04 C50.2 | C49.2 76.77,47.75 C50.2 | J2.6 78.9,55.54 v78.87,55.5 | v84.96,63.63 84.9,63.56 84.53,63.56 84.48,63.61 82.66,63.61 82.61,63.56 J2.GND1 | J2.GND4 94.68,63.56 v94.61,63.5 | J2.GND3 94.8,36.26 v94.74,36.32 | J2.GND2 84.94,38.46 v85.6,39.12 | C50.2 v77.6,46.86 | C47.2 64.32,86.68 C48.2 | C46.2 64.26,84.65 C48.2 | C48.2 63.88,86.36 v62.1,86.36
  other vias: 61.98,83.57 68.96,76.71 65.15,76.71 89.03,25.15 89.03,22.61 95.38,25.15 95.38,22.61 95.38,20.07 89.03,20.07 87.12,18.16 87.12,53.72 96.01,56.26 96.01,48.64 90.93,48.64 84.58,46.1 90.93,43.56 96.52,43.18 96.52,39.37 83.82,57.15 83.82,52.07 83.82,44.45 87.63,40.64 92.71,40.64 96.52,60.96 87.63,62.23 82.55,66.04 96.52,66.04 95.25,52.07 88.9,52.07 96.52,33.02 93.98,29.21
  pour Top (no thermals): 82.68,18.92 82.17,18.41 82.17,17.65 82.68,17.14 90.04,17.14 92.08,19.18 97.28,19.18 97.92,19.81 97.92,25.65 96.9,26.67 87.63,26.67 86.49,25.53 86.49,19.94 85.47,18.92
  pour Top (no thermals): 82.17,41.02 104.65,41.02 104.78,40.89 104.78,59.82 85.6,59.82 76.96,51.18 76.96,46.23
  pour Route2 (rank 5): 60.45,46.86 60.45,24.26 58.8,22.61 58.8,-9.4 60.83,-11.43 122.17,-11.43 122.17,68.2 121.54,68.83 80.14,68.83 72.77,76.2 72.77,109.09 71.5,110.36 56.01,110.36 47.62,101.98 47.62,75.31 50.29,72.64 53.72,72.64 55.88,70.48 55.88,57.15 59.56,53.47 59.56,47.75
  pour Bottom (rank 3): 107.95,66.04 105.54,68.45 77.09,68.45 68.71,60.07 68.71,47.5 90.3,25.91 101.73,25.91 107.95,32.13
GND_EXT  (via drill 0.35)
  other vias: 96.9,74.04 96.9,86.74 93.09,74.04 85.34,74.04 82.3,75.31 79.12,76.58 81.66,86.23 87.88,85.47 87.63,83.31 93.09,86.87
  pour Bottom (rank 3, no thermals): 76.33,101.73 76.58,101.98 99.98,101.98 103.25,98.71 103.25,71.5 81.66,71.5 76.33,76.83
  pour Top (rank 3, no thermals): 76.33,101.73 76.58,101.98 99.98,101.98 104.52,97.44 104.52,71.5 81.66,71.5 76.33,76.83
  pour Route2 (rank 3, no thermals): 76.33,101.73 76.58,101.98 99.98,101.98 107.06,94.9 107.06,71.5 81.66,71.5 76.33,76.83
  pour Route15 (rank 3, no thermals): 76.33,101.73 76.58,101.98 99.98,101.98 105.79,96.17 105.79,71.5 81.66,71.5 76.33,76.83
MA_RANGE_SENSE  (via drill 0.35)
  Top 0.152: R5.E2 25.9,7.43 26.81,7.43 27.3,7.92 v27.3,9.14 | U4.15 23.39,23.22 v23.37,23.24 23.37,24.26 TP8.TP
  Bottom 0.152: v27.3,9.14 24.64,11.81 24.64,21.97 v23.37,23.24
N$1
  Top 0.152: R17.1 R16.1 16.96,42.42 C17.2 16.96,39.48 U7.1
N$2
  Top 0.152: R16.2 R15.1
N$3
  Top 0.152: U7.4 19.62,36.9 18.86,37.66 C17.1 18.86,42.42 R15.2 19.12,42.48 21.02,44.39 R14.1
N$4
  Top 0.152: R13.1 R12.2
N$5
  Top 0.152: U6.1 19.12,30.09 C14.2 | C14.2 19.12,33.15 R13.2 18.86,33.21 17.65,34.42 U7.3 | TP14.TP 18.29,31.11 C14.2
N$6
  Top 0.152: U4.6 19.48,20.62 21.65,22.8 21.65,22.86 21.65,22.92 | U4.11 23.95,20.62 21.65,22.92 | U4.14 22.86,22.55 21.65,23.76 | 21.65,23.76 R10.1 23.24,25.65 TP13.TP | 21.65,22.92 21.65,23.76
N$7
  Top 0.152: R11.2 23.18,35.12 21.27,33.21 R12.1 21.08,31.18 C14.1 21.02,28.13 21.65,27.5 U6.4
N$8  (via drill 0.35)
  Top 0.305: U4.13 C11.1
  Top 1.27: v26.67,20.7 C11.1 28.63,21.91 C12.1 28.83,21.72 L1.1
N$9
  Top 0.152: U10.1 73.53,32.35 73.53,35.18 74.55,36.2 SJ16.2
N$10
  Top 0.152: U10.3 72.66,29.86 TP17.TP SJ17.1 70.87,31.75 SJ18.3
N$11
  Top 0.152: R22.2 75.25,18.54 74.55,18.54 73.09,20 R23.1
  Top 1.27: Q6.3 75.82,20.02 R22.2
  pour Top (no thermals): 76.58,18.54 77.72,19.68 77.72,22.48 74.68,22.48 74.68,20.19 75.18,19.68 75.18,18.54
N$12
  Top 0.152: SJ15.2 77.6,24.51 77.09,24 75.31,24 74.55,24.77 74.55,27.08 U10.7
N$13
  Top 0.61: 16.64,37.85 U7.2
  Top 1.016: SJ7.2 16.64,37.85
N$15
  Top 0.152: U6.3 19.8,25.71 R10.2
N$16
  Top 1.27: R7.1 C9.-
N$17
  pour Top (no thermals): 26.42,10.41 26.42,8 23.37,8 22.73,8.64 22.73,10.41
N$18
  Top 0.61: U6.2 18.92,28.45 18.67,28.7
  Top 1.016: SJ5.2 18.54,28.83 18.67,28.7
N$19
  Top 0.152: TP15.TP 14.8,44.32 R17.2 R19.1 14.67,46.74 SJ10.2
N$20
  Top 1.27: R8.1 C10.-
N$21
  Top 0.152: U10.13 87.47,30.51 SJ13.2
N$22
  Top 1.27: R6.1 C8.-
N$23
  Top 0.152: Q3.4 39.02,77.95 R4.2 41.22,78.04 C2.1
N$24
  Top 0.508: U5.5 39.93,23.04 C7.1
N$25
  Top 0.152: SJ11.2 18.92,46.86 C20.1
N$26
  Top 0.152: U10.12 84.31,29.86 86.61,27.56 90.68,27.56 91.19,28.07 91.19,29.97 90.81,30.35 SJ14.2
N$27
  Top 0.152: R36.1 R35.2 87.94,38.92 SJ34.2 87.25,38.23 82.55,38.23 73.53,47.24 63.25,47.24 JP25.7
N$28  (via drill 0.35)
  Top 0.152: R32.1 R31.2 | SJ31.2 71.19,38.17 R31.2 | v69.22,36.58 R31.2
  Bottom 0.152: JP25.5 65.79,44.7 65.79,40.01 v69.22,36.58
N$29
  Top 0.152: R36.2 SJ35.1
N$30
  Top 0.152: R32.2 67.12,40.01 SJ33.1
N$31
  Top 0.152: R26.1 71.09,19.08 | 71.09,19.08 70.81,18.8 U11.1 69.28,18.22 68.96,17.91 66.93,17.91 66.23,17.21 R28.1 | TP23.TP 71.63,18.54 71.09,19.08
N$32
  Top 0.152: SJ22.2 77.72,36.2 78.23,35.69 78.23,33.78 76.07,31.62 76.07,29.46 75.82,29.21 U10.4
N$33
  Bottom 0.152: J1.4 91.81,79.36 90.3,77.85 88.52,77.85 SJ26.1
N$34
  Top 0.152: R23.2 69.15,21.34 R25.1 68.27,21.4 67.38,20.51 U11.3
N$35
  Top 0.152: SJ18.2 72.01,33.4 72.52,32.89 72.52,31.5 73.5,30.51 U10.2
N$36  (via drill 0.35)
  Top 0.152: IC1.4 61.8,17.27 v60.96,17.27 59.94,18.29 TP20.TP | v78.87,19.05 78.87,19.92 Q6.1
  Bottom 0.152: v60.96,17.27 60.96,17.41 61.33,17.78 77.41,17.78 R30.2 77.66,17.84 v78.87,19.05
N$37
  Top 0.152: R24.2 71.12,15.05 R26.2 70.93,17.4 67.69,17.4 67.38,17.08 U11.4
N$38
  pour Top (no thermals): 19.56,39.12 19.56,37.59 20.7,37.59 21.08,37.21 21.08,36.83 22.73,36.83 22.73,39.62 24,40.89 25.53,40.89 25.53,41.91 23.62,41.91 22.23,40.51 20.95,40.51
N$39
  pour Top (no thermals): 22.35,82.8 22.35,78.87 22.86,78.36 27.05,78.36 28.07,79.38 28.07,82.8 27.43,83.44 22.99,83.44
N$40
  Top 0.406: U9.6 33.5,40.68 C33.1
  Top 1.27: C34.1 33.21,38.42 C33.1
N$41  (via drill 0.35)
  Top 0.152: TP18.TP 40.39,37.08 JP11.2
  Top 0.406: U9.4 v35.69,41.98 34.35,41.98 C36.1
  Bottom 0.152: SJ20.1 40.64,36.83 JP11.2 38.35,37.21 35.81,39.75 35.81,41.85 v35.69,41.98
N$42
  Top 1.27: Q1.2 21.55,84.67 JP2.2
  Top 1.778: D1.A 19.79,82.91 JP2.2
N$43
  Bottom 0.152: U12.10 67.12,79.88 R34.1
N$44
  Top 0.152: R1.2 LED1.C
N$45
  Top 0.152: U10.5 75.8,28.56 76.45,29.21 76.45,31.37 78.74,33.66 78.74,36.2 79.38,36.83 SJ21.2
N$46
  pour Top (no thermals): 21.72,29.72 21.72,28.19 22.73,28.19 22.99,27.94 22.99,26.92 24.77,26.92 25.15,27.3 25.15,30.1 26.04,30.99 27.69,30.99 27.69,32 25.65,32 24.64,30.99 22.99,30.99
N$47
  Top 0.152: U5.3 35.81,26.29 36.58,27.05 36.58,30.23 36.32,30.48 TP9.TP
N$48
  Bottom 0.152: J2.1 75.07,43.04 66.93,51.18 JP27.1
N$49
  Bottom 0.152: J2.2 73.34,45.54 65.15,53.72 JP27.2
N$50
  Bottom 0.152: J2.5 69.14,53.04 65.91,56.26 JP27.3
N$51
  Bottom 0.152: J2.7 66.8,57.96 65.96,58.8 JP27.4
N$52  (via drill 0.35)
  Top 0.152: SJ30.2 60.45,89.41 60.07,89.03 60.07,86.49 61.85,84.71 64.9,84.71 67.18,82.42 v68.45,82.42
  Bottom 0.152: U12.12 v68.45,82.42
N$53  (via drill 0.35)
  Top 0.152: SJ32.2 64.77,89.41 66.42,87.76 66.42,85.09 67.82,83.69 v68.45,83.69
  Bottom 0.152: U12.13 v68.45,83.69
N$54  (via drill 0.35)
  Top 0.152: SJ27.2 86.49,89.28 87.12,88.65 87.12,86.36 86.11,85.34 84.71,85.34 v81.79,82.42
  Bottom 0.152: U12.5 v81.79,82.42
N$55  (via drill 0.35)
  Top 0.152: SJ29.2 81.66,89.28 80.45,88.08 80.45,84.77 v81.53,83.69
  Bottom 0.152: U12.4 v81.53,83.69
N$56
  Top 0.152: U4.3 16.08,22.55 14.35,20.83 SJ2.1
N$57
  Top 0.152: SJ1.1 14.58,23.22 U4.2
N$58
  Bottom 0.152: J2.8 68.74,59.66 67.06,61.34 JP27.5
N$59
  Top 1.27: R9.2 C13.1
N$60
  Bottom 0.152: J2.9 76.94,40.54 67.82,49.66 63.5,49.66 62.48,50.67 62.48,62.87 63.5,63.88 JP27.6
N$61
  Bottom 0.152: J2.CD 71.37,60.96 65.91,66.42 JP27.7
N$62
  Bottom 0.152: J2.WP 72.33,62.16 65.53,68.96 JP27.8
N$63
  pour Top (no thermals): 23.37,92.96 23.37,85.85 19.94,85.85 18.29,84.2 18.29,81.28 14.86,77.85 13.08,77.85 12.45,78.49 12.45,86.11 17.91,91.57 17.91,92.96
N$65
  Top 0.406: U9.16 43,45.48 C30.1
  Top 1.27: C32.1 43.12,49.59 C31.1 C30.1
  pour Top (rank 2, no thermals): 42.16,43.81 43.81,43.81 43.94,43.94 43.94,52.32 43.43,52.83 42.42,52.83 41.78,52.2 41.78,44.2
N$66  (via drill 0.35)
  Top 0.152: SJ19.1 v52.7,31.37 53.72,31.37 C25.1
  Top 0.305: U8.15 53.39,28.94 C27.1
  Top 1.27: C27.1 54.55,32.06 C25.1 54.48,34.13 L2.1
  Bottom 0.152: SJ24.1 57.28,29.34 55.75,29.34 53.72,31.37 v52.7,31.37
OPAMP_LEADS
  Top 0.152: IC1.1 63.17,19.05 65.34,19.05 R28.2
PSU_EN  (via drill 0.35)
  Top 0.152: SJ12.2 v67.31,27.56
  Bottom 0.152: JP9.1 83.06,12.95 80.77,15.24 80.77,20.07 78.49,22.35 72.52,22.35 v67.31,27.56
PSU_EN_CONTROL  (via drill 0.35)
  Top 0.152: SJ9.1 66.29,30.35 v67.18,30.35
  Top 0.305: R18.2 Q5.1 65.79,31.61 SJ9.1
  Bottom 0.152: v67.18,30.35 64.52,33.02 JP25.6
PSU_EN_LEAD
  Top 0.305: R20.1 64.45,33.42 64.07,33.04 | 64.07,33.04 Q5.3 | SJ9.2 64.26,32.85 64.07,33.04
  Top 1.016: SJ9.2 SJ12.1
PSU_I_CONTROL
  Top 0.152: JP25.3 65.79,44.7 63.75,44.7 63.25,44.2 63.25,38.1 62.74,37.59 62.74,26.16 | SJ23.1 69.34,27.56 67.94,26.16 62.74,26.16 | 62.74,26.16 61.28,24.7 C41.1 61.28,19.57 IC1.3
PSU_I_SENSE
  Top 0.152: SJ23.2 TP19.TP 72.87,27.91 U10.6 75.79,27.91 76.83,28.96 76.83,31.11 80.14,34.42 SJ21.1 80.9,35.31 82.74,37.15 87.82,37.15 | R35.1 87.94,37.02 87.82,37.15 | 87.82,37.15 SJ34.1
PSU_U_CONTROL  (via drill 0.35)
  Top 0.152: SJ17.2 68.33,29.84 v67.82,29.34 | JP25.1 68.33,44.7 68.33,42.8 v67.18,41.66
  Bottom 0.152: JP9.5 74.04,23.11 v67.82,29.34 67.82,32.92 70.08,35.18 70.08,36.98 67.18,39.88 v67.18,41.66
PSU_U_SENSE
  Top 0.152: R31.1 71.19,40.07 SJ31.1 73.41,39.88 SJ8.2
RANGE_MA  (via drill 0.35)
  Top 0.152: Q4.1 21.25,11.13 v21.21,11.18
  Bottom 0.152: v21.21,11.18 16,11.18 4.19,22.99 4.19,46.1 6.1,48.01 JP14.1
RANGE_UA  (via drill 0.35)
  Top 0.152: Q2.1 19.54,15.49 v20.19,15.49
  Bottom 0.152: v20.19,15.49 12.19,15.49 4.57,23.11 4.57,44.2 5.84,45.47 JP14.2
RST_ADC1
  Top 0.152: U9.9 51.93,39.38 JP15.2 56.07,39.12 R21.1
RVS_ADC1  (via drill 0.35)
  Top 0.152: v44.73,43.41 43.13,43.41 U9.15
  Bottom 0.152: JP15.1 51.56,36.58 v44.73,43.41
SCK_ADC2  (via drill 0.35)  (1 unrouted)
  Top 0.152: U8.13 55.24,27.94 v55.5,28.19
SCL  (via drill 0.35)
  Top 0.152: U10.10 v82.79,28.56 v82.8,28.57
  Bottom 0.152: JP25.2 69.6,40.69 81.71,28.57 v82.8,28.57
SCLK_ADC1
  Top 0.152: U9.12 48.57,41.33 51.44,44.2 JP15.4
SDA  (via drill 0.35)
  Top 0.152: U10.9 80.5,27.94 v81.92,27.94
  Bottom 0.152: JP25.4 67.06,43.05 68.33,41.78 68.33,40.89 81.28,27.94 v81.92,27.94
SDI_ADC1
  Top 0.152: U9.10 50.19,40.03 50.55,40.39 53.85,40.39 54.48,41.02 54.48,45.85 53.59,46.74 JP15.5
SDI_ADC2  (via drill 0.35)  (1 unrouted)
  Top 0.152: v56.64,27.43 v56.64,27.44 U8.12
  Bottom 0.152: SJ24.2 57.66,27.43 v56.64,27.43
SDO-0_ADC1
  Top 0.152: U9.13 48.08,41.98 49.91,43.81 49.91,48.77 50.42,49.28 JP15.6
SDO-1_ADC1
  Top 0.152: U9.14 47.58,42.63 49.28,44.32 49.28,49.66 51.44,51.82 JP15.7
SDO_ADC2  (via drill 0.35)  (1 unrouted)
  Top 0.152: U8.14 54.25,28.44 v54.36,28.54
TOADC  (via drill 0.35)
  Top 0.152: SJ10.1 12.89,48.45 R19.2 | R19.2 16.96,48.45 SJ11.1 | U9.7 35.2,40.03 v35.05,39.88 35.05,38.1 TP16.TP 35.43,35.81 41.4,29.84 41.4,28.96 42.42,27.94 U8.4 | R19.2 16,49.59 JP7.1
  Bottom 0.152: JP7.1 22.35,51.18 33.66,39.88 v35.05,39.88
UA_RANGE_SENSE  (via drill 0.35)
  Top 0.152: R3.1 23.38,14.3 23.38,15.35 v23.37,15.37 | v22.73,19.94 22.76,19.96 U4.10 25.88,19.96 26.16,19.68 28.45,19.68 TP6.TP
  Bottom 0.152: v22.73,19.94 23.37,19.3 v23.37,15.37
  pour Top (no thermals): 20.19,14.48 23.37,14.48 23.37,12.45 21.08,12.45 20.19,13.34
USB_EXT_N
  Bottom 0.254: U12.6 83.89,81.15 R27.2
USB_EXT_P
  Bottom 0.254: R29.2 83.63,79.88 U12.7
USB_INT_N
  Bottom 0.254: U12.11 67.12,81.15 R33.1
V_FILTR_UNREG
  pour Top (no thermals): 4.45,62.61 6.6,62.61 7.75,63.75 8.76,63.75 9.4,64.39 9.4,68.83 11.56,70.99 17.78,70.99 19.43,69.34 19.43,63.37 20.32,62.48 22.23,62.48 23.37,63.63 24.51,63.63 24.89,64.01 24.89,69.34 26.8,71.25 33.15,71.25 34.92,69.47 34.92,63.12 35.56,62.48 37.47,62.48 38.86,63.88 40.01,63.88 40.39,64.26 40.39,73.53 39.37,74.55 38.23,74.55 36.07,76.71 36.07,78.61 35.94,78.74 33.02,78.74 29.34,75.06 8.38,75.06 3.81,70.48 3.81,63.25
VBAT  (via drill 0.55)
  Top 1.27: BT1.1 69.34,70.1 JP10.1
  other vias: 69.98,66.93 73.79,70.87 77.09,69.22 77.6,65.79 75.06,63.25
  pour Top (no thermals): 68.33,72.64 75.31,72.64 79.88,68.07 79.88,63.37 76.96,60.45 70.48,60.45 67.44,63.5 67.44,71.75
VDD  (via drill 0.35, 0.55)
  Top 0.406: U9.2 35.97,43.28 34.99,44.26 C28.1
  Top 0.61: U5.2 C6.1
  Top 1.27: SJ4.1 v28.83,33.02 | SJ6.1 v26.8,42.93 | C24.1 34.99,48.57 C26.1 C28.1 36.13,45.72 v36.7,45.72 | C6.1 v32.51,29.46
  other vias: 22.61,56.26 20.07,56.26 25.15,61.34 27.69,61.34 30.23,56.26 32.77,56.26
  pour Top (no thermals): 19.81,61.34 22.23,61.34 24,63.12 24.89,63.12 25.78,64.01 25.78,65.28 26.04,65.53 26.8,65.53 27.05,65.28 27.05,64.14 28.07,63.12 28.83,63.12 29.84,62.1 29.84,59.94 30.73,59.05 33.02,59.05 34.04,58.04 34.04,55.12 32.13,53.21 20.7,53.21 19.3,54.61 19.3,60.83
  pour Route15 (rank 4): 55.37,61.59 55.37,63.75 54.61,64.52 52.7,64.52 49.66,67.56 25.91,67.56 19.3,60.96 19.3,53.21 21.97,50.55 21.97,43.18 23.88,41.27 28.07,41.27 28.07,36.96 25.27,34.16 25.27,32.51 26.29,31.5 28.83,31.5 31.62,28.7 33.02,28.7 38.61,34.29 38.61,49.15 34.16,53.59 34.16,61.09 34.92,61.85 37.08,61.85 38.1,62.87 44.83,62.87 46.48,61.21 46.48,60.96 54.74,60.96
VDD1  (via drill 0.35)
  Top 0.152: v82.93,92.58 83.44,92.08 SJ29.3 SJ27.3
  Bottom 0.152: U12.3 78.39,84.96 77.72,85.63 SJ28.1 77.72,91.31 78.99,92.58 v82.93,92.58
  Bottom 0.61: U12.3 83.25,84.96 C43.1
VDD2  (via drill 0.35)
  Top 0.152: SJ30.1 SJ32.1 68.58,90.93 69.72,89.79 69.72,85.98 68.71,84.96 v68.33,84.96
  Bottom 0.61: U12.14 v68.33,84.96 66.61,84.96 C46.1
VIN  (via drill 0.55)
  Top 0.152: LED1.A 30.68,79.66 F1.2
  Top 1.27: JP9.2 91.95,15.49 C22.+
  other vias: 94.74,14.99 88.39,13.08 94.74,12.45 92.2,10.92 96.01,16.89 93.47,17.53 88.39,15.62 35.31,88.27 33.02,88.27 33.02,85.72 35.31,85.72 37.59,88.27 37.59,85.72 38.99,82.68
  pour Top (no thermals): 28.96,89.66 38.86,89.66 41.02,87.5 41.02,83.69 39.88,82.55 39.88,79.38 32.77,79.38 29.08,75.69 27.43,75.69 27.05,76.07 27.05,77.34 28.96,79.25
  pour Top (no thermals): 90.42,16.64 82.55,16.64 82.04,16.13 82.04,15.11 82.68,14.48 85.22,14.48 86.11,13.59 86.11,12.06 88.01,10.16 95.12,10.16 97.92,12.95 97.92,17.91 97.16,18.67 92.46,18.67
  pour Route15: 82.68,29.84 78.99,26.16 78.99,13.97 83.95,9.02 97.41,9.02 105.54,17.14 105.54,64.26 100.97,68.83 80.01,68.83 72.77,76.07 72.77,100.2 70.61,102.36 -3.05,102.36 -9.53,95.89 -9.53,81.03 -3.68,75.18 38.35,75.18 44.07,80.9 61.34,80.9 64.01,78.23 64.01,68.71 73.91,58.8 86.36,58.8 89.66,55.5 89.66,31.62 87.88,29.84
VREF_EXT  (via drill 0.35)
  Top 0.152: U5.6 39.24,26.29 38.23,27.3 TP12.TP v38.23,31.75
  Top 0.508: U5.6 42.35,26.29 R9.1
  Top 1.27: C29.1 45.34,26.16 | R9.1 45.28,26.22 C29.1 | U8.8 45.57,25.93 C29.1
  Bottom 0.152: v38.23,31.75 38.23,32.64 JP11.1 40.77,35.18 42.93,35.18 SJ20.2
  pour Top (no thermals): 38.86,26.04 41.27,26.04 41.66,25.65 43.69,25.65 44.07,25.27 48.77,25.27 48.77,26.54 47.12,26.54 46.74,26.92 41.27,26.92 41.15,26.8 38.99,26.8 38.73,26.54 38.73,26.16
VSS  (via drill 0.35)
  Top 1.27: SJ5.1 v14.99,30.35 | SJ7.1 v12.7,36.32
  pour Route15 (no thermals): 5.46,27.69 11.56,27.69 12.83,28.96 17.14,28.96 17.91,29.72 17.91,36.45 16.51,37.85 11.05,37.85 9.65,36.45 9.65,34.04 8.38,32.77 5.84,32.77 4.57,31.5 4.57,28.57